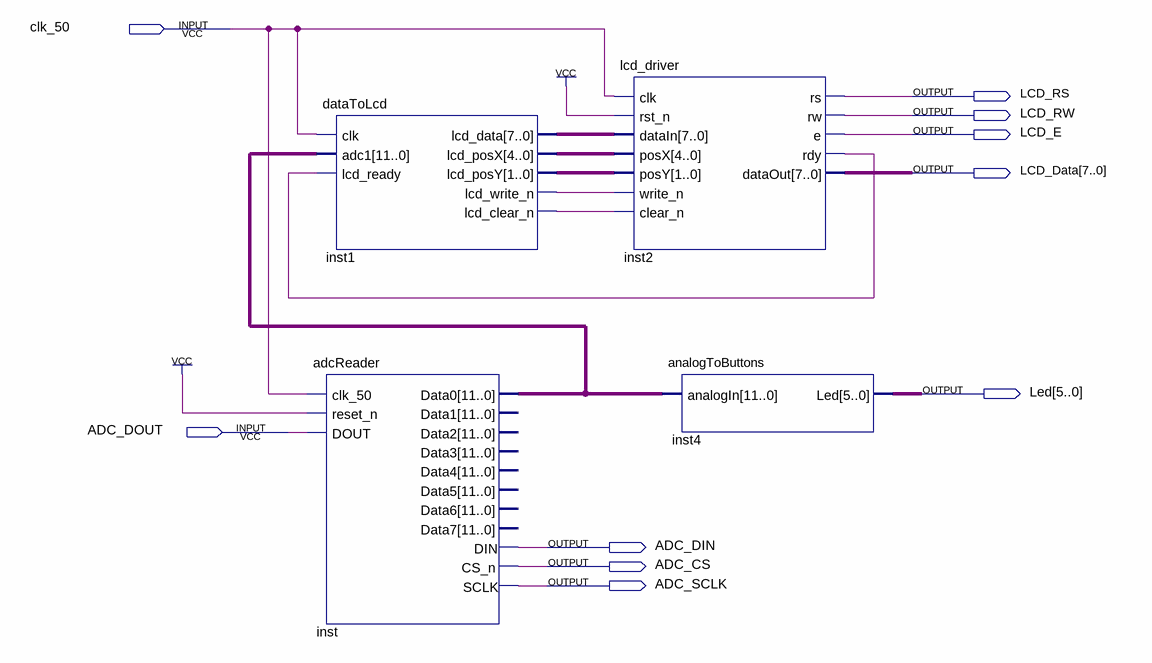
[diagram p0: schematic sheet]
// Quartus schematic ex4_buttonsToLEDs.bdf as structural Verilog: 4 symbols, 10 pins
module ex4_buttonsToLEDs (
  input  clk_50,
  input  ADC_DOUT,
  output LCD_RS,
  output LCD_RW,
  output LCD_E,
  output [7:0] LCD_Data,
  output [5:0] Led,
  output ADC_DIN,
  output ADC_CS,
  output ADC_SCLK
);

  wire inst1_lcd_clear_n, inst1_lcd_write_n, inst2_rdy;
  wire [1:0] inst1_lcd_posy;
  wire [4:0] inst1_lcd_posx;
  wire [7:0] inst1_lcd_data;
  wire [11:0] inst_data0;

  dataToLcd inst1 (
    .clk(clk_50), .adc1(inst_data0), .lcd_ready(inst2_rdy), .lcd_data(inst1_lcd_data),
    .lcd_posX(inst1_lcd_posx), .lcd_posY(inst1_lcd_posy), .lcd_write_n(inst1_lcd_write_n),
    .lcd_clear_n(inst1_lcd_clear_n));
  adcReader inst (
    .clk_50(clk_50), .reset_n(1'b1), .DOUT(ADC_DOUT), .Data0(inst_data0), .DIN(ADC_DIN), .CS_n(ADC_CS),
    .SCLK(ADC_SCLK));  // open: Data1, Data2, Data3, Data4, Data5, Data6, Data7
  lcd_driver inst2 (
    .clk(clk_50), .rst_n(1'b1), .dataIn(inst1_lcd_data), .posX(inst1_lcd_posx), .posY(inst1_lcd_posy),
    .write_n(inst1_lcd_write_n), .clear_n(inst1_lcd_clear_n), .rs(LCD_RS), .rw(LCD_RW), .e(LCD_E),
    .rdy(inst2_rdy), .dataOut(LCD_Data));
  analogToButtons inst4 (.analogIn(inst_data0), .Led(Led));
endmodule
